# EAGLE design magloop_ad8129 (EAGLE 9.6.2)
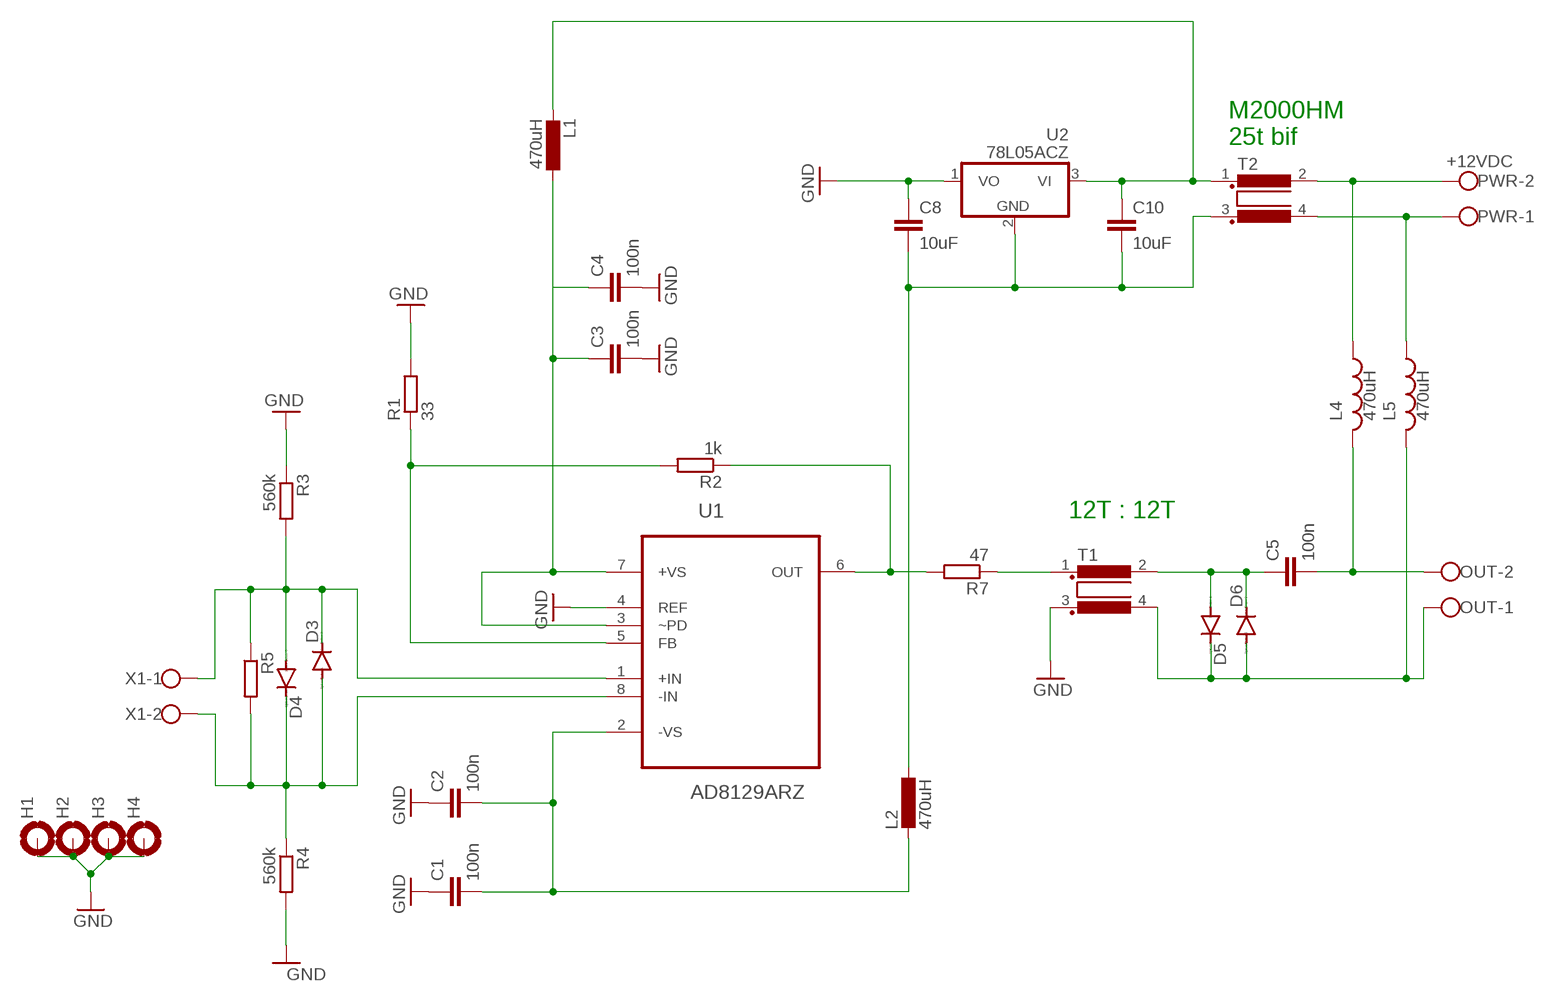
[diagram p0: schematic, sheet 1]

## Parts
C1  100n  C_0805_SMD  [C0805]
C2  100n  C_0805_SMD  [C0805]
C3  100n  C_0805_SMD  [C0805]
C4  100n  C_0805_SMD  [C0805]
C5  100n  C_0805_PTH  [C0805K]
C8  10uF  C-EUC1206K  [C1206K]
C10  10uF  C-EUC1206K  [C1206K]
D3  LL4148  CGRM4001-G  [SOD-123_MINI-SMA]
D4  LL4148  CGRM4001-G  [SOD-123_MINI-SMA]
D5  CGRM4001-G  [SOD-123_MINI-SMA]
D6  CGRM4001-G  [SOD-123_MINI-SMA]
H1  MOUNT-PAD-ROUND3.0  [3,0-PAD]
H2  MOUNT-PAD-ROUND3.0  [3,0-PAD]
H3  MOUNT-PAD-ROUND3.0  [3,0-PAD]
H4  MOUNT-PAD-ROUND3.0  [3,0-PAD]
L1  470uH  L-EU0207/10  [0207/10]
L2  470uH  L-EU0207/10  [0207/10]
L4  470uH  L_0805_PTH  [M0805]
L5  470uH  L_0805_PTH  [M0805]
OUT  W237-102  [W237-102]
PWR  +12VDC  W237-102  [W237-102]
R1  33  R_0805_SMD  [R0805W]
R2  1k  R_0805_SMD  [R0805W]
R3  560k  R_0805_PTH  [R0805]
R4  560k  R_0805_PTH  [R0805]
R5  R_0805_PTH  [R0805]
R7  47  R-EU_R1206  [R1206]
T1  R1405UB1/2  [B1/2]
T2  R1405UB1/2  [B1/2]
U1  AD8129ARZ  [SOIC127P600X175-8N]
U2  78L05ACZ  [TO-92]
X1  W237-102  [W237-102]

## Nets
GND: C1.1 C2.1 C3.2 C4.2 C8.1 H1.B3,0(MOUNT) H2.B3,0(MOUNT) H3.B3,0(MOUNT) H4.B3,0(MOUNT) R1.2 R3.1 R3.P$1 R4.2 R4.P$2 T1.3 U1.4(REF) U2.1(VO)
N$1: D3.C D4.A R3.2 R3.P$2 R5.1 R5.P$1 U1.1(+IN) X1.1
N$3: D3.A D4.C R4.1 R4.P$1 R5.2 R5.P$2 U1.8(-IN) X1.2
N$4: R1.1 R2.2 U1.5(FB)
N$5: R2.1 R7.2 U1.6(OUT)
N$9: C3.1 C4.1 L1.1 U1.3(~PD) U1.7(+VS)
N$10: C10.1 L1.2 T2.1 U2.3(VI)
N$11: C8.2 C10.2 L2.1 T2.3 U2.2(GND)
N$12: L5.1 L5.P$1 PWR.1 T2.4
N$13: L4.1 L4.P$1 PWR.2 T2.2
N$14: C1.2 C2.2 L2.2 U1.2(-VS)
N$15: R7.1 T1.1
N$16: C5.1 C5.P$1 D5.A D6.C T1.2
N$17: C5.2 C5.P$2 L4.2 L4.P$2 OUT.2
N$18: D5.C D6.A L5.2 L5.P$2 OUT.1 T1.4

## Notes on the sheet
- M2000HM
  25t bif
- 12T : 12T

## Library data of the parts
C1-C4 = mylib:C_0805_SMD
C5 = mylib:C_0805_PTH
C8 C10 = rcl_home_optimized:C-EU: CAPACITOR, European symbol; SPICEPREFIX: C
D3-D6 = diode:CGRM400*-G: Molded plasitc,JEDEC SOD-123/Mini SMA Source: Comchip CGRM4001-G.pdf
H1-H4 = holes:MOUNT-PAD-ROUND: MOUNTING PAD, round
L1 L2 = rcl_home_optimized:L-EU: INDUCTOR, European symbol; SPICEPREFIX: L
L4 L5 = mylib:L_0805_PTH
OUT PWR X1 = con-wago-500:W237-102: WAGO SCREW CLAMP; MPN: 237-102; OC_FARNELL: unknown; OC_NEWARK: 70K9898
R1 R2 = mylib:R_0805_SMD
R3-R5 = mylib:R_0805_PTH
R7 = rcl_home_optimized:R-EU_: RESISTOR, European symbol; SPICEPREFIX: R
T1 T2 = inductor-nkl:R1405U: Gleichtakt-Entstördrossel (über typ. 5MHz) common mode choke (above typ.5MHz); OC_FARNELL: unknown; OC_NEWARK: unknown
U1 = AD8129ARZ:AD8129ARZ: Low Cost 270 MHz Differential Receiver Amplifiers Check prices <https://pricing.snapeda.com/parts/AD8129ARZ/Analog%20Devices/view-part?ref=eda>; AVAILABILITY: In Stock; DESCRIPTION: Differential Amplifier 1 Circuit - 8-SOIC; MF: Analog Devices; MP: AD8129ARZ; PACKAGE: SOIC-8 Analog Devices; PRICE: None; PURCHASE-URL: https://pricing.snapeda.com/search/part/AD8129ARZ/?ref=eda
U2 = 78L05ACZ:78L05ACZ: Check prices <https://pricing.snapeda.com/parts/78L05ACZ/STMicroelectronics/view-part?ref=eda>; AVAILABILITY: In Stock; DESCRIPTION: Linear Voltage Regulator IC Positive Fixed 1 Output 100mA TO-92-3; MF: STMicroelectronics; MP: 78L05ACZ; PACKAGE: TO-92 STMicroelectronics; PRICE: None; PURCHASE-URL: https://pricing.snapeda.com/search/part/78L05ACZ/?ref=eda

## Board
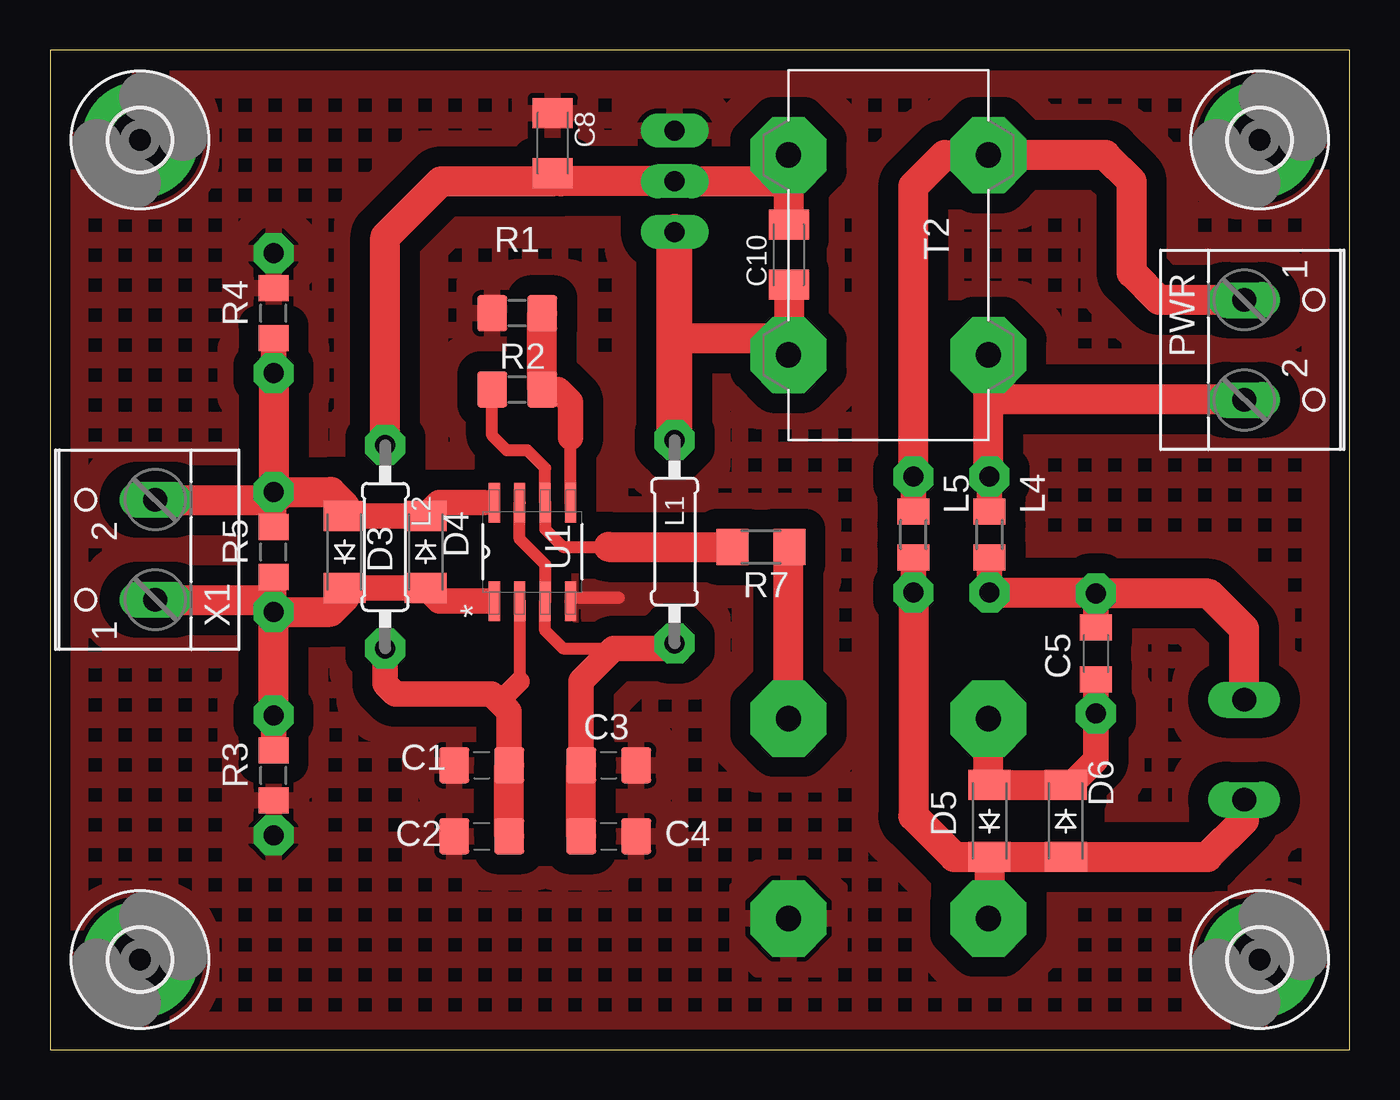
[diagram p1: board, top side]
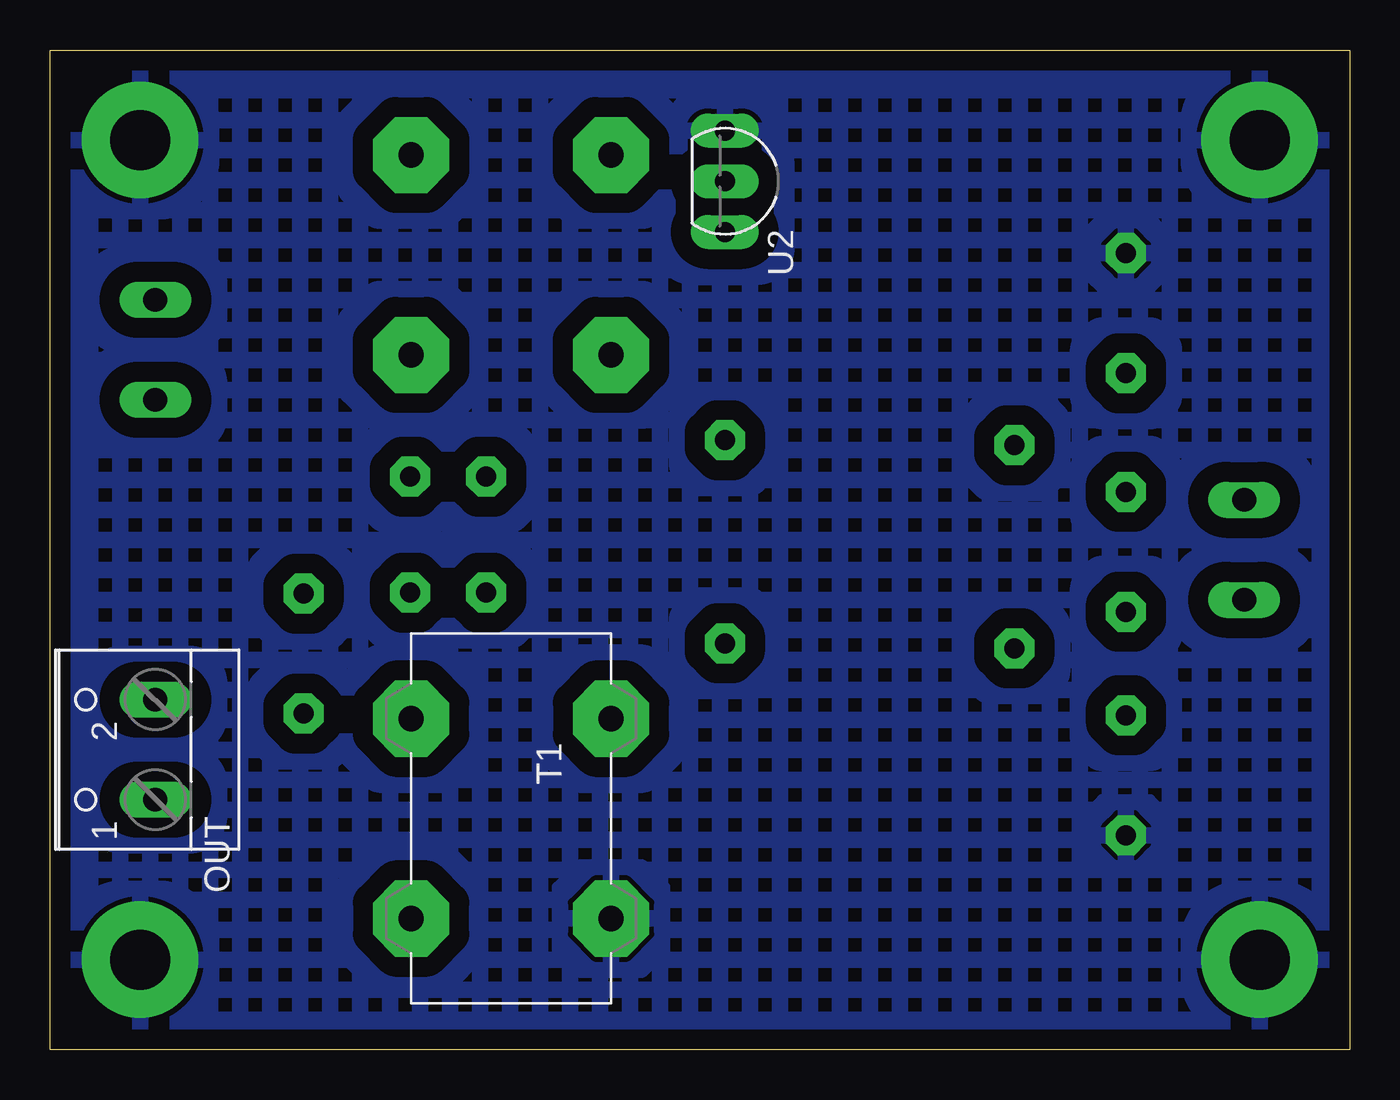
[diagram p2: board, bottom side, seen from below]

Size 65 x 50 mm. Coordinates in mm from the lower left corner, seen from the top.
Outline: 0,0 65,0 65,50 0,50 0,0
Copper layers (1*16): Top 0.035mm / dielectric 1.5mm / Bottom 0.035mm
Design rules "default": minimum track width 6mil, minimum drill 0.35mm, track to track 6mil, track to pad 6mil, pad to pad 6mil, via to via 6mil, smd to smd 6mil, copper to edge 40mil, drill to drill 6mil, minimum pad ring 10mil, minimum via ring 8mil, stop-mask expansion 4mil, vias tented up to drill 0mil, thermal gap 10mil

### Footprints (pad centres in the part's own frame; a part is rotated, then mirrored left to right if it is on the bottom)
C0805 = smd 1.5 x 1.8: 1 -1.377,0; 2 1.377,0
C0805K = smd 1.3 x 1.6: 1 -1.3,0; 2 1.3,0 | drill 1 pad 2 octagon: P$1 -3,0; P$2 3,0
C1206K = smd 1.5 x 2: 1 -1.5,0; 2 1.5,0
SOD-123_MINI-SMA = smd 1.5 x 2.1: A 1.8,0; C -1.8,0
3,0-PAD = drill 3 pad 5.842: B3,0 0,0
0207/10 = drill 1 pad 2 octagon: 1 -5.08,0; 2 5.08,0
M0805 = smd 1.3 x 1.6: 1 -1.15,0; 2 1.15,0 | drill 1 pad 2 octagon: P$1 -2.9,0; P$2 2.9,0
W237-102 = drill 1.194 long: 1 -2.5,-1.27; 2 2.5,-1.27
R0805W = smd 1.5 x 1.8: 1 -1.252,0; 2 1.252,0
R0805 = smd 1.3 x 1.5: 1 -1.25,0; 2 1.25,0 | drill 1 pad 2 octagon: P$1 -3,0; P$2 3,0
R1206 = smd 1.6 x 1.803: 1 -1.422,0; 2 1.422,0
B1/2 = drill 1.27 pad 3.81 octagon: 1 -5,5; 2 -5,-5; 3 5,5; 4 5,-5
SOIC127P600X175-8N = smd 1.981 x 0.559: 1 -2.464,1.905; 2 -2.464,0.635; 3 -2.464,-0.635; 4 -2.464,-1.905; 5 2.464,-1.905; 6 2.464,-0.635; 7 2.464,0.635; 8 2.464,1.905
TO-92 = drill 1 pad 1.7 long: 1 -2.54,0; 2 0,0; 3 2.54,0

### Placement (x,y rotation side)
C1  21.59,14.22 0 top
C2  21.59,10.67 0 top
C3  27.94,14.22 0 top
C4  27.94,10.67 0 top
C5  52.32,19.81 90 top
C8  25.15,45.34 270 top
C10  36.96,39.75 90 top
D3  14.73,24.89 90 top
D4  18.8,24.89 270 top
D5  46.99,11.43 90 top
D6  50.8,11.43 270 top
H1  4.5,4.5 0 top
H2  4.5,45.5 0 top
H3  60.5,4.5 0 top
H4  60.5,45.5 0 top
L1  31.24,25.4 90 top
L2  16.76,25.15 270 top
L4  46.99,25.76 270 top
L5  43.18,25.76 270 top
OUT  61,15 90 bottom
PWR  61,35 270 top
R1  23.37,36.83 180 top
R2  23.37,33.02 0 top
R3  11.18,13.72 90 top
R4  11.18,36.83 90 top
R5  11.18,24.89 90 top
R7  35.56,25.15 180 top
T1  41.94,11.55 270 bottom
T2  41.94,39.74 90 top
U1  24.13,24.89 90 top
U2  31.24,43.43 270 bottom
X1  4,25 90 top

### Tracks (layer width: path | path; a pad name or v marks a point on that pad's centre or on a via)
GND
  Top 0.61: U1.4 26.21,22.61 28.45,22.61
  pour Top (isolate 1, hatched): -1.52,52.58 -1.52,-2.29 68.07,-2.29 68.07,52.58
  pour Bottom (isolate 1, hatched): 67.82,-3.05 -1.78,-3.05 -1.78,53.34 67.82,53.34
N$1
  Top 0.61: 21.84,22.43 U1.1
  Top 1.27: 21.84,22.43 19.46,22.43 D4.A D3.C | R3.P$2 R3.2 | R5.1 R5.P$1
  Top 1.5: X1.1 10.57,22.5 R5.P$1 | R3.P$2 R5.P$1 | R5.P$1 11.43,21.64 | R5.P$1 14.02,21.89 14.73,22.61 D3.C
N$3
  Top 0.61: U1.8 21.72,27.36
  Top 1.27: 21.72,27.36 19.46,27.36 D4.C D3.A | R4.P$1 R4.1 | R5.2 R5.P$2
  Top 1.5: X1.2 10.78,27.5 | 10.78,27.5 R5.P$2 | R4.P$1 R5.P$2 | R5.P$2 10.78,27.5 | R5.P$2 11.43,27.64 | R5.P$2 14.04,27.89 14.73,27.2 D3.A
N$4
  Top 0.61: U1.5 26.04,30.61
  Top 1.27: 26.04,30.61 26.04,32.38 25.4,33.02 R2.2
  Top 1.5: R2.2 R1.1
N$5
  Top 0.61: 27.94,25.15 25.65,25.15 24.77,26.04 U1.6 24.77,29.08 23.88,29.97 22.86,29.97 22.12,30.72 R2.1
  Top 1.5: 27.94,25.15 R7.2
N$9
  Top 0.61: U1.7 23.5,25.53 24.77,24.26 U1.3 24.77,20.95 25.65,20.07 28.19,20.07
  Top 1.27: C3.1 26.56,18.43 28.19,20.07 30.99,20.07 L1.1
  Top 1.5: C4.1 C3.1
N$10
  Top 1.5: 31.24,35.56 36.12,35.56 T2.1 36.96,34.77 C10.1
  Top 1.8: L1.2 31.24,35.56 U2.3
N$11
  Top 1.27: C8.2 25.15,43.43
  Top 1.5: L2.1 16.76,40.64 19.56,43.43 25.15,43.43 | C10.2 36.94,41.27 T2.3 36.94,43.54 36.83,43.43 U2.2 25.55,43.43 C8.2
N$12
  Top 1.27: L5.1 L5.P$1
  Top 1.5: PWR.1 55.46,37.5 54.1,38.86 54.1,43.43 52.79,44.74 T2.4 44.74,44.74 43.18,43.18 L5.P$1
N$13
  Top 1.27: L4.P$1 L4.1
  Top 1.5: L4.P$1 46.94,28.71 46.94,32.51 | 46.94,32.51 T2.2 | PWR.2 59.72,32.51 46.94,32.51
N$14
  Top 0.61: U1.2 23.5,18.41 | 22.86,17.78 22.86,17.02 22.97,16.91
  Top 1.016: 23.5,18.41 22.86,17.78
  Top 1.27: C1.2 22.97,16.91 22.1,17.78 17.27,17.78 16.76,18.29 L2.2
  Top 1.5: C2.2 C1.2
N$15
  Top 1.5: T1.1 36.94,25.1 R7.1
N$16
  Top 1.27: D6.C 51.05,13.23 52.32,14.5 C5.P$1 C5.1
  Top 1.5: D6.C D5.A 46.94,13.28 T1.2
N$17
  Top 1.27: C5.2 C5.P$2 52.28,22.86 | L4.P$2 L4.2
  Top 1.5: OUT.2 59.73,21.04 57.96,22.81 C5.P$2 52.28,22.86 L4.P$2
N$18
  Top 1.27: L5.P$2 L5.2
  Top 1.5: D5.C D6.A 57.89,9.63 59.73,11.47 OUT.1 | D5.C 46.99,6.61 T1.4 | L5.P$2 43.18,11.68 45.23,9.63 D5.C